# EasyEDA Pro project 电路图.eprj

# Schematic Schematic1
Board Name: Board1; Create Date: 2025-07-12; Page Name: P1; Project Name: 电路图; Schematic Name: Schematic1; Update Date: 2026-01-09; Company: 嘉立创EDA; Drawed: 陈师傅; Page Size: A4; Version: V1.0
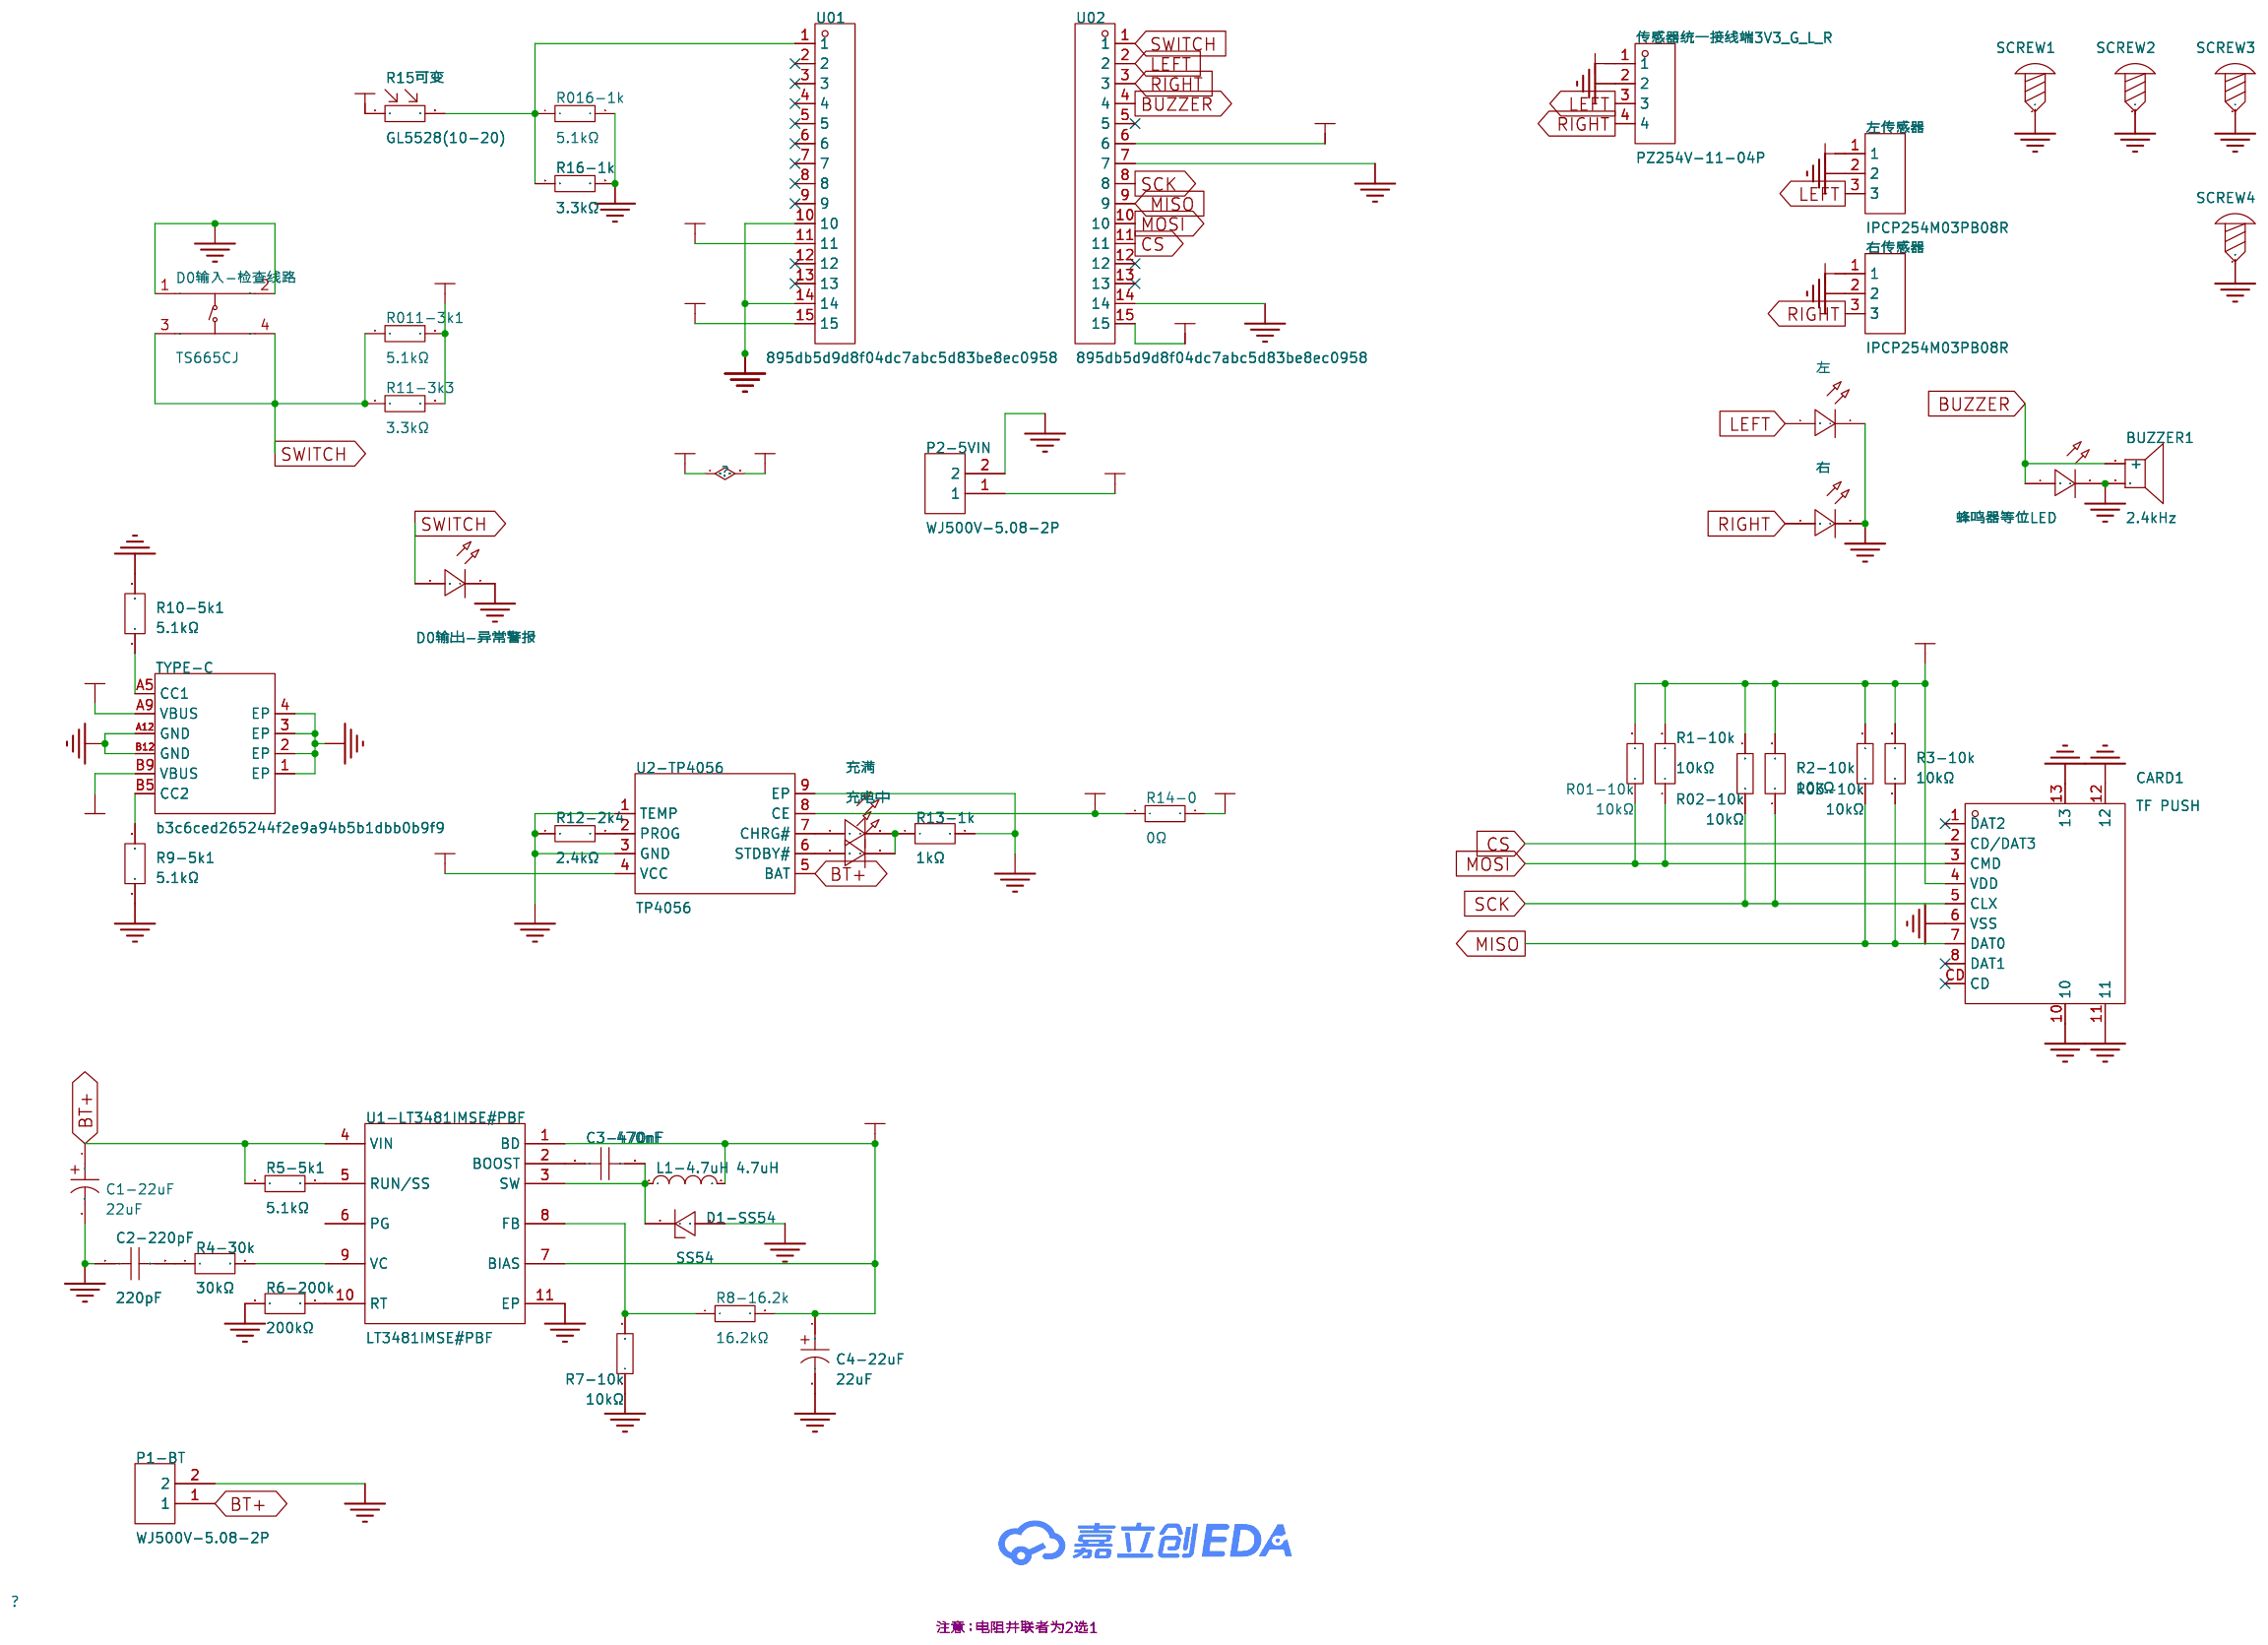
[diagram p0: schematic sheet]

## Parts
BUZZER1  2.4kHz  [BUZ-TH_BD12.0-P7.60-D0.6-FD]
C1-22uF  22uF  [CAP-TH_BD5.0-P2.00-D0.5-FD-1]
C2-220pF  220pF  [C1206]
C3-470nF  470nF  [C1206]
C4-22uF  22uF  [CAP-TH_BD5.0-P2.00-D0.5-FD-1]
CARD1  TF PUSH  [TF-SMD_TF-PUSH]
D0输入-检查线路  TS665CJ  [SW-TH_4P-L6.0-W6.0-P4.50-LS6.5]
D0输出-异常警报  -  [LED-TH_5mm]
D1-SS54  SS54  [SMA_L4.3-W2.6-LS5.0-FD]
L1-4.7uH  4.7uH  [IND-SMD_L7.0-W6.6]
P1-BT  WJ500V-5.08-2P  [CONN-TH_2P-P5.00_WJ500V-5.08-2P]
P2-5VIN  WJ500V-5.08-2P  [CONN-TH_2P-P5.00_WJ500V-5.08-2P]
R1-10k  10kΩ  [RES-TH_BD2.3-L6.3-P10.30-D0.6]
R01-10k  10kΩ  [R0603]
R02-10k  10kΩ  [R0603]
R2-10k  10kΩ  [RES-TH_BD2.3-L6.3-P10.30-D0.6]
R03-10k  10kΩ  [R0603]
R3-10k  10kΩ  [RES-TH_BD2.3-L6.3-P10.30-D0.6]
R4-30k  30kΩ  [R1206]
R5-5k1  5.1kΩ  [R0603]
R6-200k  200kΩ  [R1206]
R7-10k  10kΩ  [R0603]
R8-16.2k  16.2kΩ  [R0603]
R9-5k1  5.1kΩ  [RES-TH_BD2.3-L6.5-P10.50-D0.5]
R10-5k1  5.1kΩ  [RES-TH_BD2.3-L6.5-P10.50-D0.5]
R011-3k1  5.1kΩ  [R0603]
R11-3k3  3.3kΩ  [RES-TH_BD2.4-L6.3-P10.30-D0.6]
R12-2k4  2.4kΩ  [RES-TH_BD2.4-L6.3-P10.30-D0.6]
R13-1k  1kΩ  [RES-TH_BD2.7-L6.2-P10.20-D0.4]
R14-0  0Ω  [RES-TH_BD2.5-L6.5-P10.50-D0.6]
R15可变  GL5528(10-20)  [RES-TH_L5.1-W4.3-P3.40-D0.5]
R016-1k  5.1kΩ  [R0603]
R16-1k  3.3kΩ  [RES-TH_BD2.4-L6.3-P10.30-D0.6]
SCREW1  -  [M3螺丝]
SCREW2  -  [M3螺丝]
SCREW3  -  [M3螺丝]
SCREW4  -  [M3螺丝]
TYPE-C  b3c6ced265244f2e9a94b5b1dbb0b9f9  [USB-C-SMD_HC-TYPE-C-6P-010B]
U01  895db5d9d8f04dc7abc5d83be8ec0958  [HDR-TH_15P-P2.54-V-F-1]
U1-LT3481IMSE#PBF  LT3481IMSE#PBF  [MSOP-10_L3.0-W3.0-P0.50-LS5.0-BL-EP]
U02  895db5d9d8f04dc7abc5d83be8ec0958  [HDR-TH_15P-P2.54-V-F-1]
U2-TP4056  TP4056  [ESOP-8_L4.9-W3.9-P1.27-LS6.0-BL-EP]
传感器统一接线端3V3_G_L_R  PZ254V-11-04P  [HDR-TH_4P-P2.54-V-M]
充满  -  [LED-TH_5mm]
充电中  -  [LED-TH_5mm]
右  -  [LED-TH_5mm]
右传感器  IPCP254M03PB08R  [HDR-TH_3P-P2.54-H-M-W10.4]
左  -  [LED-TH_5mm]
左传感器  IPCP254M03PB08R  [HDR-TH_3P-P2.54-H-M-W10.4]
蜂鸣器等位LED  -  [LED-TH_5mm]

## Library data of the parts
BUZZER1 = TMB12A05_C96093: LCSC Part Name: TMB12A05; Supplier Part: C96093; Manufacturer: 华能; Manufacturer Part: TMB12A05; Supplier Footprint: 插件,D=12mm; JLCPCB Part Class: 扩展库; Datasheet: https://atta.szlcsc.com/upload/public/pdf/source/20241025/8A17FE04D767D19A35A06DEF9A82AB1E.pdf; Supplier: LCSC; Driver Circuitry: 有源(内含驱动线路); Technology: 电磁式; Voltage - Supply: 4V~8V; Sound Pressure Level(SPL): 85dB; Diameter(φD): 12mm; Height: 9.8mm
C1-22uF C4-22uF = SHC50V22UF03EC0750: LCSC Part Name: 停产 22uF ±20% 50V; Supplier Part: C5263893; Supplier Footprint: 插件,D5xL11mm; JLCPCB Part Class: 扩展库; Supplier: LCSC; Tolerance: ±20%; Voltage Rating: 50V; Pin Spacing: 2mm; Diameter: 5mm; Height - Seated (Max): 11mm
C2-220pF = FCC1206B221K102FT: LCSC Part Name: 220pF ±10% 1kV; Supplier Part: C5137559; Manufacturer: FOJAN(富捷); Supplier Footprint: 1206; JLCPCB Part Class: 扩展库; Datasheet: https://item.szlcsc.com/datasheet/FCC1206B221K102FT/5747011.html; Supplier: LCSC; Tolerance: ±10%; Voltage Rating: 1kV; Temperature Coefficient: X7R
C3-470nF = AC1206KKX7R9BB474: LCSC Part Name: 470nF ±10% 50V; Supplier Part: C2173665; Manufacturer: YAGEO(国巨); Supplier Footprint: 1206; JLCPCB Part Class: 扩展库; Datasheet: https://item.szlcsc.com/datasheet/AC1206KKX7R9BB474/2265731.html; Supplier: LCSC; Tolerance: ±10%; Voltage Rating: 50V; Temperature Coefficient: X7R
CARD1 = TF PUSH: 卡连接方式:自弹式;卡类型:MicroSD卡(TF卡);连接器类型:卡座;本体最大高度:2mm;工作温度范围:-20℃~+90℃;; LCSC Part Name: 自弹式 MicroSD卡(TF卡) 卡座; Supplier Part: C393941; Manufacturer: SHOU HAN(首韩); Supplier Footprint: SMD; JLCPCB Part Class: 扩展库; Datasheet: https://atta.szlcsc.com/upload/public/pdf/source/20191011/C393941_0DDD896EE907FEB750D8B7B8982E2A67.pdf; Supplier: LCSC; Card Connection Mode: 自弹式; Card Type: MicroSD卡(TF卡); Connector Type: 卡座; Additional Card Detection Pins: 无; Maximum Body Height: 2mm; Operating Temperature Range: -20℃~+90℃
D0输入-检查线路 = TS665CJ: LCSC Part Name: 6*6*5mm 直插 轻触开关; Supplier Part: C393938; Manufacturer: SHOU HAN(首韩); Supplier Footprint: 插件; JLCPCB Part Class: 扩展库; Datasheet: https://atta.szlcsc.com/upload/public/pdf/source/20190521/C393938_BDABEAC600B4C55E200A80AA129B70BC.pdf; Supplier: LCSC; Circuit: 单刀单掷; Actuator Style: 圆形按钮; Mounting Style: 直插; Switch Length: 6mm; Switch Width: 6mm; Switch Height: 5mm; Contact Current: 50mA; Voltage Rating (DC): 12V
D0输出-异常警报 充电中 右 左 = LED_TH-R_5mm: Supplier Footprint: 插件
D1-SS54 = SS54_C7420369: LCSC Part Name: 电压:40V 电流:5A; Supplier Part: C7420369; Manufacturer: R+O(宏嘉诚); Supplier Footprint: SMA(DO-214AC); JLCPCB Part Class: 扩展库; Datasheet: https://item.szlcsc.com/datasheet/SS54/8397191.html; Supplier: LCSC; Diode Configuration: 独立式; Voltage - Forward(Vf@If): 550mV@5.0A; Voltage - DC Reverse(Vr): 40V; Current - Rectified: 5A; Reverse Leakage Current (Ir): 50uA@40V; Operating Junction Temperature Range: -55℃~+125℃; Non-Repetitive Peak Forward Surge Current: 120A
L1-4.7uH = SL0630-4R7M: LCSC Part Name: 4.7uH ±20% 8A; Supplier Part: C22463821; Manufacturer: 台湾陆海; Supplier Footprint: SMD,7.1x6.6mm; JLCPCB Part Class: 扩展库; Datasheet: https://item.szlcsc.com/datasheet/SL0630-4R7M/24154963.html; Supplier: LCSC; Tolerance: ±20%; Current Rating: 6.5A; Current - Saturation (Isat): 8A
P1-BT P2-5VIN = WJ500V-5.08-2P: LCSC Part Name: 1x2P 5.08mm 直插 排数:1 每排P数:2; Supplier Part: C8465; Manufacturer: KANGNEX(康奈克斯电气); Supplier Footprint: 插件,P=5.08mm; JLCPCB Part Class: 扩展库; Datasheet: https://atta.szlcsc.com/upload/public/pdf/source/20191225/C8465_02D34CE5B5B4A53DF5891601D97FA9F4.pdf; Supplier: LCSC; Structure: 1x2P; Pitch: 5.08mm; Color: 绿色; Mounting Style: 直插; Current Rating (Max): 18A; Voltage Rating (Max): 250V; Number of Pins: 2P; Number of Rows: 1; Wire Gauge - AWG: 14~30; Wire Gauge - mm2: 2.5; Number of PINs Per Row: 2; Operating Temperature Range: -40℃~+105℃; Screw Specification: M2.5
R1-10k R2-10k R3-10k = LR1F10K: LCSC Part Name: 金属膜电阻 10kΩ ±1% 600mW; Supplier Part: C1367502; Manufacturer: TE Connectivity(泰科电子); Supplier Footprint: 插件; JLCPCB Part Class: 扩展库; Datasheet: https://item.szlcsc.com/datasheet/LR1F10K/1457791.html; Supplier: LCSC; Type: 金属膜电阻; Tolerance: ±1%; Power(Watts): 600mW; Temperature Coefficient: ±50ppm/℃; Operating Temperature: -55℃~+155℃
R01-10k R02-10k R03-10k R7-10k = 0603WAF1002T5E: 电阻类型:厚膜电阻;阻值:10kΩ;精度:±1%;功率:100mW;工作电压:75V;温度系数:±100ppm/℃;; LCSC Part Name: 厚膜电阻 10kΩ ±1% 100mW; Supplier Part: C25804; Manufacturer: UNI-ROYAL(厚声); Supplier Footprint: 0603; JLCPCB Part Class: Basic Part; Datasheet: https://atta.szlcsc.com/upload/public/pdf/source/20200306/C422600_1E6D84923E4A46A82E41ADD87F860B5C.pdf; Supplier: LCSC; Type: 厚膜电阻; Tolerance: ±1%; Power(Watts): 100mW; Voltage-Supply(Max): 75V; Temperature Coefficient: ±100ppm/℃; Operating Temperature: -55℃~+155℃
R4-30k = RCA0630KFLF: LCSC Part Name: 30kΩ ±1% 250mW; Supplier Part: C22370009; Manufacturer: HKR(香港电阻); Supplier Footprint: 1206; JLCPCB Part Class: 扩展库; Datasheet: https://item.szlcsc.com/datasheet/RCA0630KFLF/23849040.html; Supplier: LCSC; Type: 厚膜电阻; Tolerance: ±1%; Power(Watts): 250mW; Voltage-Supply(Max): 200V; Temperature Coefficient: ±100ppm/℃; Operating Temperature: -55℃~+155℃
R5-5k1 R011-3k1 R016-1k = 0603WAF5101T5E: LCSC Part Name: 5.1kΩ ±1% 100mW 厚膜电阻; Supplier Part: C23186; Manufacturer: UNI-ROYAL(厚声); Supplier Footprint: 0603; JLCPCB Part Class: 基础库; Datasheet: https://item.szlcsc.com/datasheet/0603WAF5101T5E/23913.html; Supplier: LCSC; Type: 厚膜电阻; Tolerance: ±1%; Power(Watts): 100mW; Voltage-Supply(Max): 75V; Temperature Coefficient: ±100ppm/℃; Operating Temperature: -55℃~+155℃
R6-200k = TC0650B2003T5J: LCSC Part Name: 200kΩ ±0.1% 250mW 薄膜电阻; Supplier Part: C2989381; Manufacturer: UNI-ROYAL(厚声); Supplier Footprint: 1206; JLCPCB Part Class: 扩展库; Datasheet: https://item.szlcsc.com/datasheet/TC0650B2003T5J/3448804.html; Supplier: LCSC; Type: 薄膜电阻; Tolerance: ±0.1%; Power(Watts): 250mW; Voltage-Supply(Max): 200V; Temperature Coefficient: ±50ppm/℃; Operating Temperature: -55℃~+155℃
R8-16.2k = 0603WAF1622T5E: LCSC Part Name: 16.2kΩ ±1% 100mW 厚膜电阻; Supplier Part: C22885; Manufacturer: UNI-ROYAL(厚声); Supplier Footprint: 0603; JLCPCB Part Class: 扩展库; Datasheet: https://item.szlcsc.com/datasheet/0603WAF1622T5E/23612.html; Supplier: LCSC; Type: 厚膜电阻; Tolerance: ±1%; Power(Watts): 100mW; Voltage-Supply(Max): 75V; Temperature Coefficient: ±100ppm/℃; Operating Temperature: -55℃~+155℃
R9-5k1 R10-5k1 = MF1/4W-5.1KΩ±1%T52: LCSC Part Name: 金属膜电阻 5.1kΩ ±1% 250mW; Supplier Part: C714010; Manufacturer: 华星机电; Supplier Footprint: 插件,D2.3xL6.5mm; JLCPCB Part Class: 扩展库; Datasheet: https://atta.szlcsc.com/upload/public/pdf/source/20200731/C713882_AE8EB1102749D7E4FB4FB13DC898C429.pdf; Supplier: LCSC; Type: 金属膜电阻; Tolerance: ±1%; Power(Watts): 250mW; Temperature Coefficient: ±200ppm/℃
R11-3k3 R16-1k = MFR50SFTE52-3K3: LCSC Part Name: 金属膜电阻 3.3kΩ ±1% 500mW 铜脚，圆柱状直插; Supplier Part: C173154; Manufacturer: YAGEO(国巨); Supplier Footprint: 插件,D2.4xL6.3mm; JLCPCB Part Class: 扩展库; Datasheet: https://atta.szlcsc.com/upload/public/pdf/source/20240715/954B77424FA37AD87C8D0E9E8395A6B5.pdf; Supplier: LCSC; Type: 金属膜电阻; Tolerance: ±1%; Power(Watts): 500mW; Temperature Coefficient: ±50ppm/℃; Operating Temperature: -55℃~+155℃
R12-2k4 = MFR-25FTE52-2K4: LCSC Part Name: 金属膜电阻 2.4kΩ ±1% 250mW 铜脚，圆柱状直插; Supplier Part: C172998; Manufacturer: YAGEO(国巨); Supplier Footprint: 插件,D2.4xL6.3mm; JLCPCB Part Class: 扩展库; Datasheet: https://atta.szlcsc.com/upload/public/pdf/source/20191118/C457825_18355E864DE4965678DC27B0EBC3E21E.pdf; Supplier: LCSC; Type: 金属膜电阻; Tolerance: ±1%; Power(Watts): 250mW; Temperature Coefficient: ±50ppm/℃; Operating Temperature: -55℃~+155℃
R13-1k = MF1/4W-1K±1%-ST52: LCSC Part Name: 金属膜电阻 1kΩ ±1% 250mW; Supplier Part: C2903245; Manufacturer: VO(翔胜); Supplier Footprint: 插件,D2.7xL6.2mm; JLCPCB Part Class: 扩展库; Datasheet: https://atta.szlcsc.com/upload/public/pdf/source/20241217/72FEFC4F99972FE0FB9B38B807463E29.pdf; Supplier: LCSC; Type: 金属膜电阻; Tolerance: ±1%; Voltage-Supply(Max): 250V; Power(Watts): 250mW; Temperature Coefficient: ±100ppm/℃; Operating Temperature: -55℃~+155℃
R14-0 = RN1/4W0RT/BA1: LCSC Part Name: 金属膜电阻 0Ω ±1% 250mW; Supplier Part: C410698; Manufacturer: Tyohm(幸亚电阻); Supplier Footprint: 插件,D2.4xL6.4mm; JLCPCB Part Class: 扩展库; Datasheet: https://item.szlcsc.com/datasheet/RN1%252F4W0RT%252FBA1/401619.html; Supplier: LCSC; Type: 金属膜电阻; Tolerance: ±1%; Power(Watts): 250mW
R15可变 = GL5528(10-20)_C10081: Supplier Part: C10081; Manufacturer: JCHL(晶创和立); Supplier Footprint: 插件,P=3.4mm; JLCPCB Part Class: 扩展库; Datasheet: https://atta.szlcsc.com/upload/public/pdf/source/20200417/C515010_C10502EF7F431E893A7F20DB83F527F0.pdf; Supplier: LCSC; Dark Resistance: 1MΩ; Cell Resistance @ Illuminance: 10kΩ~20kΩ; Voltage - Max: 150V; Wavelength - Peak: 540nm
SCREW1-SCREW4 = M3螺丝: Supplier Footprint: 插件
TYPE-C = HC-TYPE-C-6P-010C: 连接器类型:Type-C;协议标准:-;公母:母;安装方式:卧贴;触点数量:6P;端口数量:1;额定电流 - 电源:3A;工作温度:-25℃~+85℃;; LCSC Part Name: 黑色 Type-C 母 卧贴 TYPE-C-6P 板上型无弹 L6.8mm 304不锈钢 LCP; Supplier Part: C19274014; Manufacturer: HC(虹成电子); Supplier Footprint: SMD; JLCPCB Part Class: 扩展库; Datasheet: https://atta.szlcsc.com/upload/public/pdf/source/20250217/CDACBD6800B28C1A11746C396D8A6A67.pdf; Supplier: LCSC; Connector Type: Type-C; Gender: 母; Mounting Type: 卧贴; Number of Contacts: 6P; Number of Ports: 1; Current Rating-Power: 3A; Voltage Rating: 5V; Connect-Disconnect Life: 5千次; Center Height: 1.58mm; Length: 6.8mm; Detection color: 黑色; Operating Temperature: -25℃~+85℃
U01 U02 = BX-PM2.54-1-15PY: 插孔结构:1x15P;间距:2.54mm;行距:-;圆孔/方孔:方孔;安装方式:直插;排数:单排;总孔位数:15P;额定电流:3A;额定电压:-;插孔方向:顶部;塑高:8.5mm;触头材质:-;触头镀层:金;工作温度:-40℃~+105℃;; LCSC Part Name: 1x15P 间距:2.54mm 直插; Supplier Part: C18078136; Manufacturer: Bossie(博锡); Supplier Footprint: 插件,P=2.54mm; JLCPCB Part Class: 扩展库; Datasheet: https://atta.szlcsc.com/upload/public/pdf/source/20231017/E7C87C5FAA326EA1BCED90F41F0BE953.pdf; Supplier: LCSC; Holes Structure: 1x15P; Pitch: 2.54mm; Circular Hole / Square Hole: 方孔; Mounting Type: 直插; Number of Rows: 单排; Number of Positions: 15P; Current Rating: 3A; Holes Direction: 顶部; Insulation Height: 8.5mm; Contact Plating: 金; Operating Temperature: -40℃~+105℃; PIN Length: 3.2mm
U1-LT3481IMSE#PBF = LT3481IMSE#PBF: LCSC Part Name: 具有 50uA 静态电流的 36V、2A、2.8MHz 降压型开关稳压器; Supplier Part: C27276; Manufacturer: ADI(亚德诺); Supplier Footprint: MSOP-10-EP; JLCPCB Part Class: 扩展库; Datasheet: https://atta.szlcsc.com/upload/public/pdf/source/20140319/1457707024098.pdf; Supplier: LCSC
U2-TP4056 = TP4056_C725790: LCSC Part Name: 1A独立式线性锂离子电池充电器; Supplier Part: C725790; Manufacturer: UMW(友台半导体); Supplier Footprint: ESOP-8; JLCPCB Part Class: 扩展库; Datasheet: https://item.szlcsc.com/datasheet/TP4056/772193.html; Supplier: LCSC; The Chip Type: 线性充电芯片; Voltage - Supply: 3.7V~6.5V; Charge Current - Max: 1A; Charging Saturation Voltage: 4.2V; Type of Battery: 锂离子; Number of Cells: 1; Operating Temperature: -40℃~+85℃; Battery Temperature Detection: 支持; 0V Battery Charge: 支持; Supply Current (Iq): 35uA
传感器统一接线端3V3_G_L_R = PZ254V-11-04P: LCSC Part Name: 1x4P 间距:2.54mm 方针 直插; Supplier Part: C2691448; Manufacturer: XFCN(兴飞); Supplier Footprint: 插件,P=2.54mm; JLCPCB Part Class: 扩展库; Datasheet: https://item.szlcsc.com/datasheet/PZ254V-11-04P/2801085.html; Supplier: LCSC; Pin Structure: 1x4P; Pitch: 2.54mm; Circluar Pins/Square Pins: 方针; Mounting Type: 直插; Number of Rows: 单排; Number of Pins: 4P; Current Rating: 3A; Voltage Rating (Max): 250V; Length of Mating Pin: 6mm; Insulation Height: 2.5mm; Length of End Connection Pin: 3mm; Operating Temperature: -40℃~+105℃; Color: 黑色
充满 蜂鸣器等位LED = LED_TH-G_5mm: Supplier Footprint: 插件
右传感器 左传感器 = IPCP254M03PB08R: 插针结构:1x3P;间距:2.54mm;圆针/方针:方针;安装方式:弯插;排数:单排;总PIN位数:3P;额定电流:3A;额定电压:-;塑高:2.5mm;触头材质:黄铜;触头镀层:金;工作温度:-40℃~+105℃;颜色:黑色;; LCSC Part Name: 1x3P 间距:2.54mm 方针 弯插; Supplier Part: C22395593; Manufacturer: INCP; Supplier Footprint: 弯插,P=2.54mm; JLCPCB Part Class: 扩展库; Datasheet: https://atta.szlcsc.com/upload/public/pdf/source/20250208/975C7ED3E6965D9726D213BB1A1DEC82.pdf; Supplier: LCSC; Pin Structure: 1x3P; Pitch: 2.54mm; Circluar Pins/Square Pins: 方针; Mounting Type: 弯插; Number of Rows: 单排; Number of Pins: 3P; Current Rating: 3A; Insulation Height: 2.5mm; Contact Material: 黄铜; Contact Plating: 金; Operating Temperature: -40℃~+105℃; Color: 黑色

## Nets
3V3: C4-22uF.1 CARD1.4(VDD) L1-4.7uH.2 R1-10k.2 R01-10k.2 R02-10k.2 R2-10k.2 R03-10k.2 R3-10k.2 R8-16.2k.2 R011-3k1.2 R11-3k3.2 R15可变.1 U01.11 U1-LT3481IMSE#PBF.1(BD) U1-LT3481IMSE#PBF.7(BIAS) U02.6 U02.15 传感器统一接线端3V3_G_L_R.1 右传感器.1 左传感器.1
+5V: P2-5VIN.1 R14-0.2 U01.15
GND: BUZZER1.2 C1-22uF.2 C2-220pF.1 C4-22uF.2 CARD1.6(VSS) CARD1.10 CARD1.11 CARD1.12 CARD1.13 D0输入-检查线路.1(A) D0输入-检查线路.2(B) D0输出-异常警报.2(A) D1-SS54.1(A) P1-BT.2 P2-5VIN.2 R6-200k.1 R7-10k.1 R9-5k1.1 R10-5k1.2 R12-2k4.1 R13-1k.2 R016-1k.2 R16-1k.2 SCREW1.1 SCREW2.1 SCREW3.1 SCREW4.1 TYPE-C.1(EP) TYPE-C.2(EP) TYPE-C.3(EP) TYPE-C.4(EP) TYPE-C.A12(GND) TYPE-C.B12(GND) U01.10 U01.14 U1-LT3481IMSE#PBF.11(EP) U02.7 U02.14 U2-TP4056.1(TEMP) U2-TP4056.3(GND) U2-TP4056.9(EP) 传感器统一接线端3V3_G_L_R.2 右.2(A) 右传感器.2 左.2(A) 左传感器.2 蜂鸣器等位LED.2(A)
BT+: C1-22uF.1 P1-BT.1 R5-5k1.1 U1-LT3481IMSE#PBF.4(VIN) U2-TP4056.5(BAT)
BUZZER: BUZZER1.1(+) U02.4 蜂鸣器等位LED.1(C)
CS: CARD1.2(CD/DAT3) U02.11
LEFT: U02.2 传感器统一接线端3V3_G_L_R.3 左.1(C) 左传感器.3
MISO: CARD1.7(DAT0) R03-10k.1 R3-10k.1 U02.9
MOSI: CARD1.3(CMD) R1-10k.1 R01-10k.1 U02.10
RIGHT: U02.3 传感器统一接线端3V3_G_L_R.4 右.1(C) 右传感器.3
SCK: CARD1.5(CLX) R02-10k.1 R2-10k.1 U02.8
SWITCH: D0输入-检查线路.3(C) D0输入-检查线路.4(D) D0输出-异常警报.1(C) R011-3k1.1 R11-3k3.1 U02.1
USBIN: R14-0.1 TYPE-C.A9(VBUS) TYPE-C.B9(VBUS) U2-TP4056.4(VCC) U2-TP4056.8(CE)
$1N5991: R9-5k1.2 TYPE-C.B5(CC2)
$1N5992: R10-5k1.1 TYPE-C.A5(CC1)
$1N6384: R12-2k4.2 U2-TP4056.2(PROG)
$1N6472: U2-TP4056.6(STDBY#) 充电中.1(C)
$1N6520: U2-TP4056.7(CHRG#) 充满.1(C)
$1N6547: R13-1k.1 充满.2(A) 充电中.2(A)
$1N28440: R15可变.2 R016-1k.1 R16-1k.1 U01.1
$1N40882: C3-470nF.1 U1-LT3481IMSE#PBF.2(BOOST)
$1N40886: C3-470nF.2 D1-SS54.2(K) L1-4.7uH.1 U1-LT3481IMSE#PBF.3(SW)
$1N41122: R6-200k.2 U1-LT3481IMSE#PBF.10(RT)
$1N41387: R4-30k.2 U1-LT3481IMSE#PBF.9(VC)
$1N41394: C2-220pF.2 R4-30k.1
$1N41433: R5-5k1.2 U1-LT3481IMSE#PBF.5(RUN/SS)
$1N41446: R7-10k.2 R8-16.2k.1 U1-LT3481IMSE#PBF.8(FB)

Not connected (* = marked no-connect by the designer): CARD1 1(DAT2)* 8(DAT1)* CD*; U01 2* 3* 4* 5* 6* 7* 8* 9* 12* 13*; U1-LT3481IMSE#PBF 6(PG); U02 5* 12* 13*

# Board PCB1
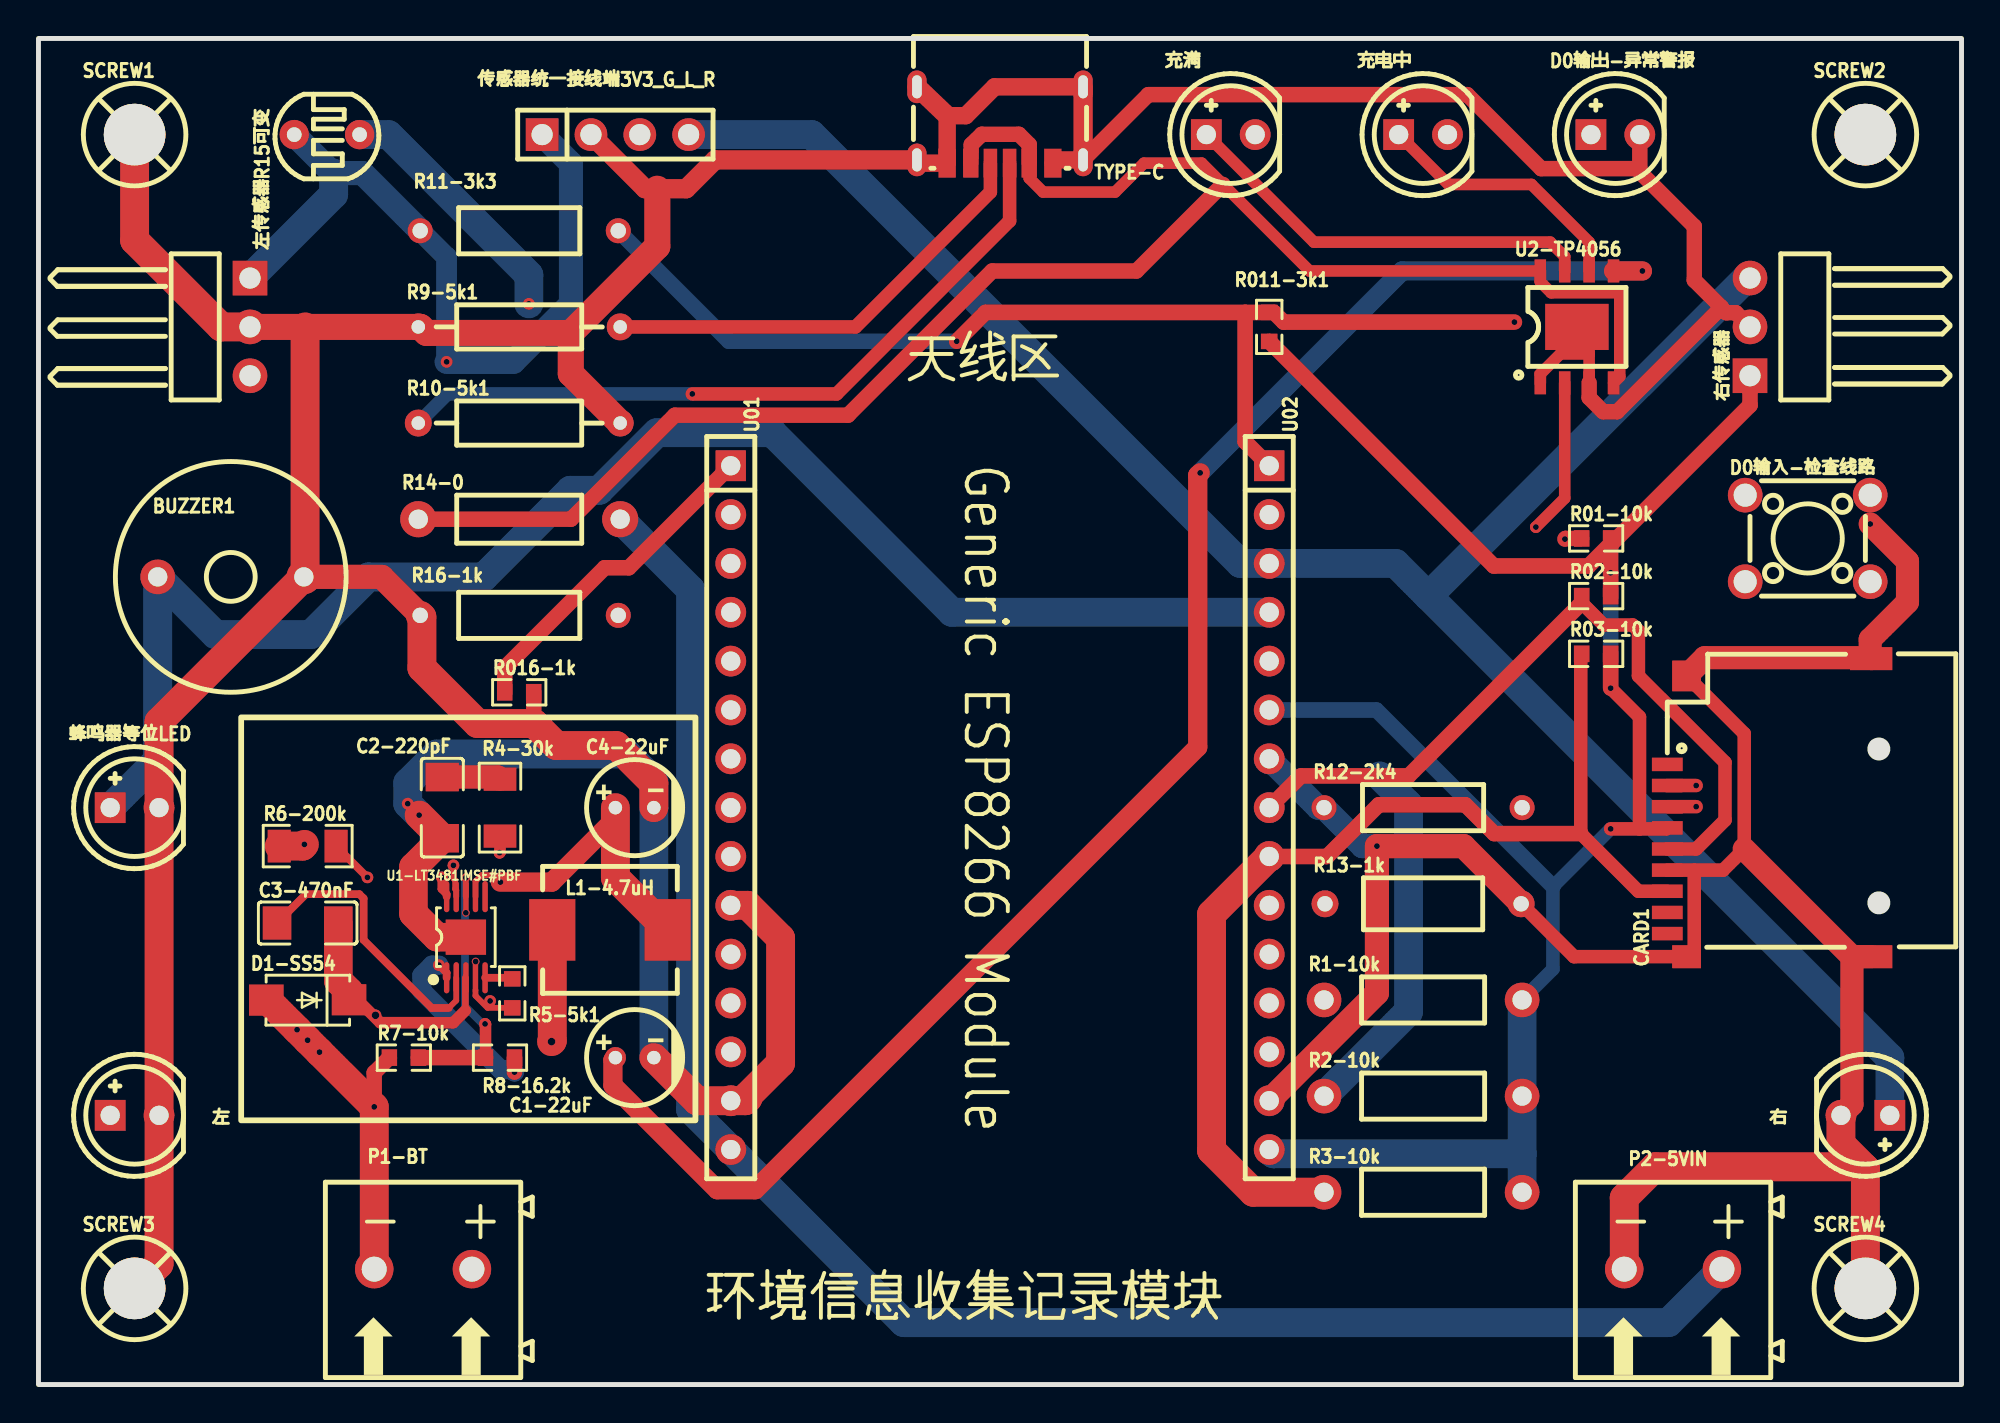
[diagram p1: board, top side]
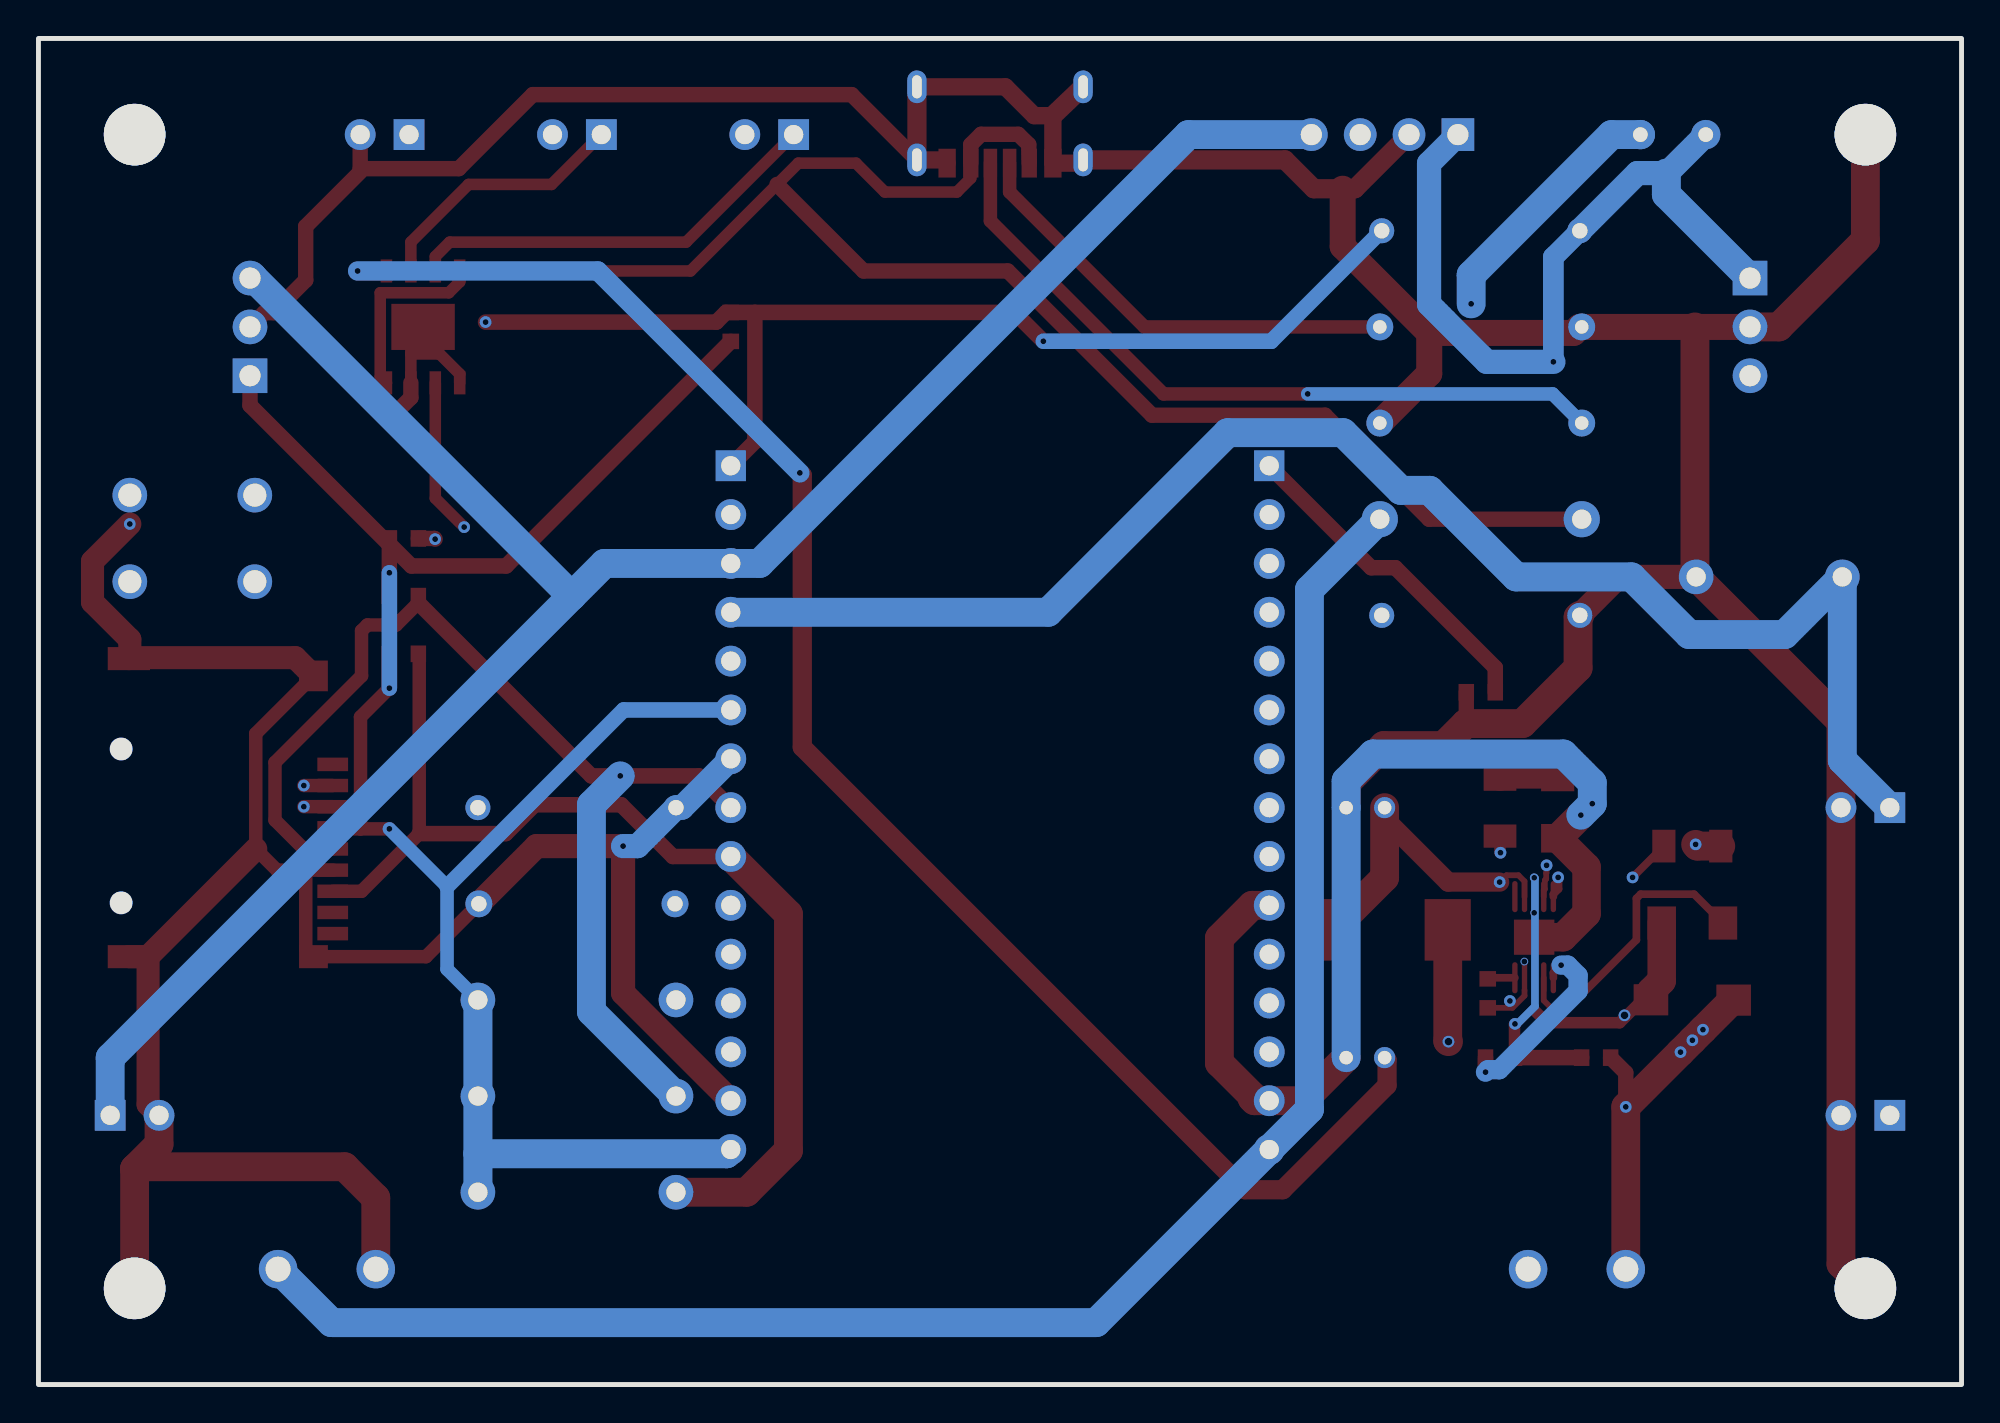
[diagram p2: board, bottom side, seen from below]

Outline 100 x 70 mm; copper layers: Top Layer, Inner1, Inner2, Bottom Layer. Coordinates in mm from the lower left corner of the outline.
Outline path: rectangle 0,70 100,0
Stack: Top Layer 0.035mm 外层铜厚1oz / Dielectric1 0.2104mm 7628 RC49% 8.6mil / Inner1 0.0152mm 内层铜厚 / Dielectric2 1.065mm 1.1mm H/HOZ Copper / Inner2 0.0152mm 内层铜厚 / Dielectric3 0.2104mm 7628 RC49% 8.6mil / Bottom Layer 0.035mm 外层铜厚1oz

## Design rules (mm)
template: 自定义配置
spacing copperThickness1oz (default): track to track 0.15, other pairs 0.152 to 0.3
spacing copperThickness2oz: track to track 0.203, other pairs 0.152 to 0.3
track width copperThickness1oz (default): min 0.3, default 1, max 3
track width copperThickness2oz: min 0.203, default 0.254, max 2.54
differential pair differentialPair (default): width min 0.127, default 0.254, max 2.54; gap min 0.152, default 0.152
via viaSize (default): diameter min 0.35, default 0.61, max 10; hole min 0.3, default 0.305, max 6.3

## Placement (name value [footprint] x y rotation side)
BUZZER1  2.4kHz  [BUZ-TH_BD12.0-P7.60-D0.6-FD]  10 42 0 top
C1-22uF  22uF  [CAP-TH_BD5.0-P2.00-D0.5-FD-1]  31 17 0 top
C2-220pF  220pF  [C1206]  21 30 90 top
C3-470nF  470nF  [C1206]  14 24 0 top
C4-22uF  22uF  [CAP-TH_BD5.0-P2.00-D0.5-FD-1]  31 30 0 top
CARD1  TF PUSH  [TF-SMD_TF-PUSH]  90 30 90 top
D0输入-检查线路  TS665CJ  [SW-TH_4P-L6.0-W6.0-P4.50-LS6.5]  92 44 0 top
D0输出-异常警报  -  [LED-TH_5mm]  82 65 0 top
D1-SS54  SS54  [SMA_L4.3-W2.6-LS5.0-FD]  14 20 0 top
L1-4.7uH  4.7uH  [IND-SMD_L7.0-W6.6]  29.72 23.64 0 top
P1-BT  WJ500V-5.08-2P  [CONN-TH_2P-P5.00_WJ500V-5.08-2P]  20 6 180 top
P2-5VIN  WJ500V-5.08-2P  [CONN-TH_2P-P5.00_WJ500V-5.08-2P]  85 6 180 top
R1-10k  10kΩ  [RES-TH_BD2.3-L6.3-P10.30-D0.6]  72 20 0 top
R01-10k  10kΩ  [R0603]  81 44 0 top
R2-10k  10kΩ  [RES-TH_BD2.3-L6.3-P10.30-D0.6]  72 15 0 top
R02-10k  10kΩ  [R0603]  81 41 0 top
R3-10k  10kΩ  [RES-TH_BD2.3-L6.3-P10.30-D0.6]  72 10 0 top
R03-10k  10kΩ  [R0603]  81 38 0 top
R4-30k  30kΩ  [R1206]  24 30 270 top
R5-5k1  5.1kΩ  [R0603]  24.64 20.34 90 top
R6-200k  200kΩ  [R1206]  14 28 0 top
R7-10k  10kΩ  [R0603]  19 17 0 top
R8-16.2k  16.2kΩ  [R0603]  24 17 0 top
R9-5k1  5.1kΩ  [RES-TH_BD2.3-L6.5-P10.50-D0.5]  25 55 0 top
R10-5k1  5.1kΩ  [RES-TH_BD2.3-L6.5-P10.50-D0.5]  25 50 0 top
R011-3k1  5.1kΩ  [R0603]  64 55 270 top
R11-3k3  3.3kΩ  [RES-TH_BD2.4-L6.3-P10.30-D0.6]  25 60 180 top
R12-2k4  2.4kΩ  [RES-TH_BD2.4-L6.3-P10.30-D0.6]  72 30 0 top
R13-1k  1kΩ  [RES-TH_BD2.7-L6.2-P10.20-D0.4]  72 25 0 top
R14-0  0Ω  [RES-TH_BD2.5-L6.5-P10.50-D0.6]  25 45 0 top
R15可变  GL5528(10-20)  [RES-TH_L5.1-W4.3-P3.40-D0.5]  15 65 90 top
R16-1k  3.3kΩ  [RES-TH_BD2.4-L6.3-P10.30-D0.6]  25 40 180 top
R016-1k  5.1kΩ  [R0603]  25 36 0 top
SCREW1  -  [M3螺丝]  5 65 0 top
SCREW2  -  [M3螺丝]  95 65 0 top
SCREW3  -  [M3螺丝]  5 5 0 top
SCREW4  -  [M3螺丝]  95 5 0 top
TYPE-C  b3c6ced265244f2e9a94b5b1dbb0b9f9  [USB-C-SMD_HC-TYPE-C-6P-010B]  50 65.5 180 top
U01  895db5d9d8f04dc7abc5d83be8ec0958  [HDR-TH_15P-P2.54-V-F-1]  36 30 270 top
U1-LT3481IMSE#PBF  LT3481IMSE#PBF  [MSOP-10_L3.0-W3.0-P0.50-LS5.0-BL-EP]  22.22 23.26 0 top
U02  895db5d9d8f04dc7abc5d83be8ec0958  [HDR-TH_15P-P2.54-V-F-1]  64 30 270 top
U2-TP4056  TP4056  [ESOP-8_L4.9-W3.9-P1.27-LS6.0-BL-EP]  80 55 0 top
传感器统一接线端3V3_G_L_R  PZ254V-11-04P  [HDR-TH_4P-P2.54-V-M]  30 65 0 top
充满  -  [LED-TH_5mm]  62 65 0 top
充电中  -  [LED-TH_5mm]  72 65 0 top
右  -  [LED-TH_5mm]  95 14 180 top
右传感器  IPCP254M03PB08R  [HDR-TH_3P-P2.54-H-M-W10.4]  89 55 90 top
左  -  [LED-TH_5mm]  5 14 0 top
左传感器  IPCP254M03PB08R  [HDR-TH_3P-P2.54-H-M-W10.4]  11 55 270 top
蜂鸣器等位LED  -  [LED-TH_5mm]  5 30 0 top

## Footprints (pads in the part's own frame, mm; a bottom-side part is the same pattern mirrored in y, then rotated)
BUZ-TH_BD12.0-P7.60-D0.6-FD
  round 1.8 hole 1: 1(-3.8,0) 2(3.8,0)
C1206
  rect 1.485x1.728 smd: 1(-1.593,0) 2(1.593,0)
CAP-TH_BD5.0-P2.00-D0.5-FD-1
  round 1.1 hole 0.7: 1(-1,0) 2(1,0)
CONN-TH_2P-P5.00_WJ500V-5.08-2P
  round 2 hole 1.3: 1(-2.54,0) 2(2.54,0)
ESOP-8_L4.9-W3.9-P1.27-LS6.0-BL-EP
  rect 0.6x1.2 smd: 1(-1.905,-2.909) 2(-0.635,-2.909) 3(0.635,-2.909) 4(1.905,-2.909) 5(1.905,2.909) 6(0.635,2.909) 7(-0.635,2.909) 8(-1.905,2.909)
  rect 3.3x2.4 smd: 9(0,0)
HDR-TH_3P-P2.54-H-M-W10.4
  rect 1.8x1.8 hole 1.1: 1(-2.54,0)
  round 1.8 hole 1.1: 2(0,0) 3(2.54,0)
HDR-TH_4P-P2.54-V-M
  rect 1.7x1.7 hole 1.1: 1(-3.81,0)
  round 1.7 hole 1.1: 2(-1.27,0) 3(1.27,0) 4(3.81,0)
HDR-TH_15P-P2.54-V-F-1
  rect 1.6x1.575 hole 1: 1(-17.78,0)
  round 1.6 hole 1: 2(-15.24,0) 3(-12.7,0) 4(-10.16,0) 5(-7.62,0) 6(-5.08,0) 7(-2.54,0) 8(0,0) 9(2.54,0) 10(5.08,0) 11(7.62,0) 12(10.16,0) 13(12.7,0) 14(15.24,0) 15(17.78,0)
IND-SMD_L7.0-W6.6
  rect 2.4x3.2 smd: 1(-3,0) 2(3,0)
LED-TH_5mm
  rect 1.6x1.6 hole 1: 1(-1.27,0)
  round 1.6 hole 1: 2(1.27,0)
M3螺丝
  round 3.2 hole 3.2: 1(0,0)
MSOP-10_L3.0-W3.0-P0.50-LS5.0-BL-EP
  oval 0.28x1.62 smd: 1(-1,-2.11) 2(-0.5,-2.11) 3(0,-2.11) 4(0.5,-2.11) 5(1,-2.11) 6(1,2.11) 7(0.5,2.11) 8(0,2.11) 9(-0.5,2.11) 10(-1,2.11)
  rect 2.1x1.83 smd: 11(0,0)
R0603
  rect 0.806x0.864 smd: 1(-0.753,0) 2(0.753,0)
R1206
  rect 1.208x1.701 smd: 1(-1.479,0) 2(1.479,0)
RES-TH_BD2.3-L6.3-P10.30-D0.6
  round 1.8 hole 1: 1(-5.15,0) 2(5.15,0)
RES-TH_BD2.3-L6.5-P10.50-D0.5
  round 1.4 hole 0.7: 1(-5.25,0) 2(5.25,0)
RES-TH_BD2.4-L6.3-P10.30-D0.6
  round 1.3 hole 0.8: 1(-5.15,0) 2(5.15,0)
RES-TH_BD2.5-L6.5-P10.50-D0.6
  round 1.879 hole 1: 1(-5.25,0) 2(5.25,0)
RES-TH_BD2.7-L6.2-P10.20-D0.4
  round 1.4 hole 0.8: 1(-5.1,0) 2(5.1,0)
RES-TH_L5.1-W4.3-P3.40-D0.5
  round 1.524 hole 0.762: 1(0,1.7) 2(0,-1.7)
SMA_L4.3-W2.6-LS5.0-FD
  rect 1.8x1.62 smd: 1(-2.15,-0.009) 2(2.15,0.009)
SW-TH_4P-L6.0-W6.0-P4.50-LS6.5
  round 1.8 hole 1.2: 1(-3.25,2.25) 2(3.25,2.25) 3(-3.25,-2.25) 4(3.25,-2.25)
TF-SMD_TF-PUSH
  rect 0.7x1.6 smd: 1(2.25,5.3) 2(1.15,5.3) 3(0.05,5.3) 4(-1.05,5.3) 5(-2.15,5.3) 6(-3.25,5.3) 7(-4.35,5.3) 8(-5.45,5.3) CD(-6.55,5.3)
  rect 1.2x1.5 smd: 10(-7.75,4.3)
  rect 1.2x2.2 smd: 11(-7.75,-5.3) 12(7.75,-5.3)
  rect 1.6x1.5 smd: 13(6.85,4.3)
USB-C-SMD_HC-TYPE-C-6P-010B
  oval 1x1.7 hole 0.5x1.2: 1(-4.32,1.815) 2(4.32,1.815) 3(-4.32,-1.985) 4(4.32,-1.985)
  rect 0.7x1.5 smd: A5(-0.5,1.985) B5(0.5,1.985)
  rect 0.8x1.5 smd: A9(1.52,1.985) B9(-1.52,1.985)
  rect 0.9x1.5 smd: A12(2.75,1.985) B12(-2.75,1.985)

## Nets
As in the schematic.

Pads without a net: CARD1 1 8 CD; U01 2 3 4 5 6 7 8 9 12 13; U1-LT3481IMSE#PBF 6; U02 5 12 13

## Via types
v1: diameter 0.61, hole 0.305, Top Layer to Bottom Layer, 32 vias
v2: diameter 0.7, hole 0.3, Top Layer to Bottom Layer, 1 via
v3: diameter 0.4, hole 0.305, Top Layer to Bottom Layer, 1 via
v4: diameter 0.61, hole 0.4, Top Layer to Bottom Layer, 2 vias
v5: diameter 0.4, hole 0.3, Top Layer to Bottom Layer, 1 via
v6: diameter 0.45, hole 0.3, Top Layer to Bottom Layer, 1 via

## Routing (per net, layer and track width the routed paths; a pad name or vN(x,y) marks a point on that pad's centre or on a via; arc(x,y) is an arc through that point)
3V3: length 251.9
  Top Layer w0.3: U1-LT3481IMSE#PBF.7 22.72,26.17 23.04,26.49 23.66,26.49 v1(24.02,26.13)
  Top Layer w0.4: U1-LT3481IMSE#PBF.1 21.22,21.41 v1(20.82,21.81)
  Top Layer w0.7: v1(81.75,36.21) 83.25,34.71 83.25,28.9 ; CARD1.4 84.65,28.9 83.25,28.9 ; 83.25,28.9 v1(81.75,28.9)
  Top Layer w0.806: R02-10k.2 v1(81.75,42.21) 81.75,43.71 ; v1(81.75,36.21) R03-10k.2 ; 81.75,43.71 80.61,42.57 75.68,42.57 R011-3k1.2 ; 81.75,43.71 81.79,43.71 89,50.92 右传感器.1 ; v1(24.75,16.25) R8-16.2k.2
  Top Layer w1: 30,29.43 26.69,26.13 v1(24.02,26.13)
  Top Layer w1.5: C4-22uF.1 30,26.36 L1-4.7uH.2
  Inner2 w1: C4-22uF.1 30,26.67 34.28,22.38 U01.11 ; v1(24.02,26.13) 24.02,25 v1(20.82,21.81)
  Inner2 w1.077: v1(21.22,53.18) 21.22,47.03 29.97,38.28 29.97,30.42
  Inner2 w1.5: U02.15 53.84,22.38 U01.11
  Bottom Layer w0.7: v1(81.75,28.9) 78.75,25.9 78.75,21.6 R1-10k.2
  Bottom Layer w0.806: 78.75,25.9 69.57,35.08 U02.6 ; v1(81.75,42.21) v1(81.75,36.21)
  Bottom Layer w1: v1(20.82,21.81) 20.47,21.81 19.94,21.27 19.94,20.47 24.04,16.37 24.63,16.37 v1(24.75,16.25)
  Bottom Layer w1.077: R11-3k3.2 21.22,58.62 v1(21.22,53.18)
  Bottom Layer w1.256: v1(21.22,53.18) 24.69,53.18 27.69,56.18 27.69,63.5 传感器统一接线端3V3_G_L_R.1 ; R15可变.1 15.3,63 16.85,63 R11-3k3.2
  Bottom Layer w1.5: 左传感器.1 15.35,61.89 15.35,63 ; 77.15,12 R2-10k.2 R1-10k.2 ; 77.15,12 64.22,12 U02.15 ; 77.15,12 R3-10k.2
+5V: length 91.6
  Bottom Layer w1.5: P2-5VIN.1 84.76,3.22 45,3.22 U01.15 33.91,14.31 33.91,41.34 R14-0.2
GND: length 475.5
  Top Layer w0.6: U2-TP4056.3 80.63,53.59 ; 80.63,53.59 79.13,53.59 78.09,52.55 U2-TP4056.1 ; 80.63,53.59 80.63,54.36 U2-TP4056.9
  Top Layer w0.7: R13-1k.2 79.85,22.25 CARD1.10 86.1,22.65 86.1,26.75 ; 86.1,26.75 CARD1.6 ; 86.1,26.75 87.6,26.75 88.7,27.85 88.7,33.85 CARD1.13
  Top Layer w0.8: 87.5,56 87.76,55.74 88.26,55.74 右传感器.2 ; 87.5,56 87.5,56.03 86.1,57.43 86.1,60.22 83.27,63.06 ; 87.5,56 82.09,50.59 81.36,50.59 80.63,51.32 U2-TP4056.3 ; R016-1k.2 25.75,34.4 ; R7-10k.1 17.46,16.21 v1(17.46,14.44) ; TYPE-C.1 57.71,67.08 74.29,67.08 78.14,63.23 83.27,63.23 D0输出-异常警报.2
  Top Layer w0.9: TYPE-C.1 52.92,63.69 TYPE-C.B12 ; TYPE-C.2 45.85,63.52 TYPE-C.A12 47.25,65.98 48.22,65.98 49.72,67.48 TYPE-C.3
  Top Layer w1: TYPE-C.1 TYPE-C.3 ; 47.25,65.98 TYPE-C.4 ; TYPE-C.2 35.18,63.69 33.68,62.19 31.54,62.19 传感器统一接线端3V3_G_L_R.2
  Top Layer w1.2: 94.3,22.25 94.3,14.57 右.2 ; 94.3,22.25 88.7,27.85 ; 94.3,22.25 CARD1.11 ; 95.25,37.8 86.65,37.8 CARD1.13 ; 95.25,37.8 CARD1.12 ; 95.25,37.8 95.25,38.75 97.19,40.69 97.19,42.81 v1(95.25,44.75)
  Top Layer w1.256: R16-1k.2 17.85,42 BUZZER1.2 ; R13-1k.2 74.1,28 v1(69.6,28) 69.6,20.36 U02.14
  Top Layer w1.353: 32.18,62.19 32.18,59.19 27.68,54.69 ; 27.68,54.69 20.18,54.69 19.86,55 左传感器.2 ; 27.68,54.69 27.68,52.57 R10-5k1.2
  Top Layer w1.485: U1-LT3481IMSE#PBF.11 20.72,23.26 19.5,24.49 19.5,26.91 C2-220pF.1
  Top Layer w1.5: P2-5VIN.2 82.46,9.71 84.08,11.33 94.88,11.33 95,11.21 ; 左传感器.2 9.5,55 5,59.5 SCREW1.1 ; C4-22uF.2 32,31.27 30.04,33.23 26.93,33.23 25.78,34.37 22.83,34.37 19.94,37.27 19.94,39.91 R16-1k.2 ; R6-200k.1 13.74,28 v1(13.83,28.09) ; 95,11.21 SCREW4.1 ; 95,11.21 95,11.23 93.73,12.5 右.2 ; C1-22uF.2 34.24,14.76 U01.14 36.76,14.76 36.89,14.89 36.89,15.02 38.59,16.72 38.59,23.21 36.88,24.92 U01.10 ; 13.86,55 13.86,42.06 BUZZER1.2 6.27,34.47 蜂鸣器等位LED.2 左.2 6.27,6.27 SCREW3.1 ; P1-BT.2 v1(17.46,14.44) v1(14.61,17.29) v1(14,17.9) v1(13.45,18.45) 11.91,19.99 D1-SS54.1 ; v2(19.8,29.61) C2-220pF.1
  Inner2 w1.2: D0输入-检查线路.2 v1(95.25,44.75)
  Inner2 w1.5: SCREW2.1 95,60.5 89.5,55 90.25,55 91,54.25 91,50.5 ; 91,50.5 91,48.5 D0输入-检查线路.1 ; 91,50.5 D0输入-检查线路.2 ; v1(19.2,30.2) 17.09,28.09 v1(13.83,28.09) 13.83,18.83 v1(13.45,18.45) v1(14,17.9) v1(14.61,17.29)
  Bottom Layer w1.256: U02.7 66.54,30 R12-2k4.1 68.85,28 v1(69.6,28)
  Bottom Layer w1.5: v2(19.8,29.61) v1(19.2,30.2) 19.2,31.29 20.7,32.79 30.61,32.79 32,31.4 C4-22uF.2 C1-22uF.2
BT+: length 113.3
  Top Layer w0.3: 24.38,19.59 23.35,19.59 22.72,20.22 22.72,20.5
  Top Layer w1: C1-22uF.1 29.87,16.87 29.87,15.55 35.3,10.13 37.27,10.13 60.28,33.15 60.28,47.28 v1(60.41,47.41) ; U2-TP4056.5 v1(83.41,57.91)
  Inner2 w0.6: v1(23.49,19.95) 24.07,20.53 ; v3(22.73,22) 24.2,20.53
  Inner2 w1: C1-22uF.1 26.47,20.53 24.2,20.53
  Inner2 w1.6: P1-BT.1 30,13.46 C1-22uF.1
  Bottom Layer w1: v1(83.41,57.91) 70.91,57.91 v1(60.41,47.41)
BUZZER: length 80.3
  Bottom Layer w1.5: 蜂鸣器等位LED.1 6.2,32.47 BUZZER1.1 9.2,39 14.16,39 17.16,42 23.16,42 27.66,46.5 29.16,46.5 32.16,49.5 38.16,49.5 47.5,40.16 U02.4
CS: length 32
  Top Layer w0.7: CARD1.2 v1(86.2,31.15)
  Inner2 w0.7: U02.11 65.43,20.95 65.43,19.38 66.93,17.88 72.18,17.88 85.45,31.15 v1(86.2,31.15)
LEFT: length 108.6
  Inner2 w1.5: U02.2 51.03,45.24 传感器统一接线端3V3_G_L_R.3 23.77,57.5 17.77,57.5 12.73,52.46 左传感器.3 9.79,52.46 8.29,50.96 8.29,28.25 3.73,23.69 左.1
MISO: length 56.3
  Top Layer w0.7: CARD1.7 83.2,25.65 80.2,28.65 80.2,37.95 R03-10k.1
  Top Layer w0.806: U02.9 67.01,27.46 69.7,30.15 74.2,30.15 75.7,28.65 80.2,28.65
  Top Layer w1.5: U02.9 61,24.46 61,12.17 63.18,10 R3-10k.1
MOSI: length 50.4
  Top Layer w0.7: CARD1.3 v1(86.2,30.05)
  Top Layer w0.8: R01-10k.1 79.41,44 v1(79.38,43.97)
  Inner2 w0.7: v1(86.2,30.05) 86.95,30.05 87.7,30.8 87.7,31.55 86.2,33.05 83.2,33.05 70.15,20 R1-10k.1
  Inner2 w0.8: v1(79.38,43.97) 79.38,36.88 83.2,33.05
  Inner2 w1.5: U02.10 66.85,22.07 R1-10k.1
RIGHT: length 108.9
  Bottom Layer w1.5: 72.27,41 96.27,17 右.1 ; 72.27,41 88.81,57.54 右传感器.3 ; 72.27,41 70.57,42.7 U02.3 62.5,42.7 40.2,65 传感器统一接线端3V3_G_L_R.4
SCK: length 59
  Top Layer w0.7: R02-10k.1 80.25,40.65 81.4,39.5 82.9,39.5 83.2,39.2 83.2,36.85 87.7,32.35 87.7,29.35 86.2,27.85 CARD1.5
  Top Layer w0.806: U02.8 65.65,31.65 v1(69.75,31.65) 71.25,31.65 80.25,40.65
  Bottom Layer w1.5: v1(69.75,31.65) 71.25,30.15 71.25,19.4 R2-10k.1
SWITCH: length 95.9
  Top Layer w0.806: U02.1 62.75,49.03 62.75,55.75 ; 62.75,55.75 49.25,55.75 v1(47.75,54.25) ; 62.75,55.75 64.25,55.75 64.75,55.25 v1(76.75,55.25)
  Inner2 w0.806: 81.25,55.25 v1(76.75,55.25)
  Inner2 w1.5: D0输入-检查线路.4 D0输入-检查线路.3 81.25,49.25 81.25,64.48 D0输出-异常警报.1
  Bottom Layer w0.806: R11-3k3.1 35.9,54.25 v1(47.75,54.25)
USBIN: length 94.8
  Top Layer w0.6: U2-TP4056.4 82.23,52.42 82.23,56.78 78.66,56.78 78.09,57.34 U2-TP4056.8 66.09,57.91 60.49,63.52 57.49,63.52 55.99,62.02 52.24,62.02 51.52,62.73 TYPE-C.B9
  Top Layer w0.8: TYPE-C.A9 48.51,64.48 49.05,65.02 50.99,65.02 51.52,64.48 TYPE-C.B9 ; R14-0.1 27.69,45 33.09,50.41 42.09,50.41 49.59,57.91 57.09,57.91 61.59,62.41
$1N5991: length 23.7
  Top Layer w0.7: R9-5k1.2 42.49,55 49.5,62.02 TYPE-C.B5
$1N5992: length 38.1
  Top Layer w0.7: TYPE-C.A5 50.5,60.52 41.5,51.52 v1(34,51.52)
  Bottom Layer w0.7: R10-5k1.1 21.27,51.52 v1(34,51.52)
$1N6384: length 23
  Top Layer w0.6: v1(77.87,44.59) 79.37,46.09 U2-TP4056.2
  Inner2 w0.6: v1(77.87,44.59) 77.87,30.72 R12-2k4.2
$1N6472: length 13.7
  Top Layer w0.6: U2-TP4056.6 80.63,59.41 77.63,62.41 73.32,62.41 充电中.1
$1N6520: length 22
  Top Layer w0.6: 充满.1 66.32,59.41 78.62,59.41 79.37,58.66 U2-TP4056.7
$1N6547: length 51.8
  Inner2 w1.353: 70.27,62 68.4,60.13 68.4,26.5 R13-1k.1
  Inner2 w1.5: 充电中.2 73.27,63.5 71.77,62 66.27,62 充满.2
$1N28440: length 55.4
  Top Layer w0.806: R016-1k.1 24.25,37.28 29.44,42.48 30.7,42.48 U01.1
  Inner2 w1.256: U01.1 30.15,41.93 R16-1k.1
  Inner2 w1.5: v1(25.5,56.2) 28.5,53.2 30,53.2 34.5,48.7 34.5,46.28
  Bottom Layer w1.5: R15可变.2 18.2,65 25.5,57.7 v1(25.5,56.2)
$1N40882: length 15
  Top Layer w0.3: U1-LT3481IMSE#PBF.2 21.72,19.97 21.33,19.58
  Top Layer w0.4: 21.33,19.58 20.45,19.58 16.91,23.12 16.91,25.28 16.69,25.5 13.91,25.5 C3-470nF.1
$1N40886: length 29.2
  Top Layer w0.35: 22.2,19.45 22.2,21.15
  Top Layer w0.6: 22.2,19.45 21.56,18.82 17.78,18.82 16.15,20.44
  Top Layer w1.485: C3-470nF.2 15.59,21 16.15,20.44 D1-SS54.2
  Top Layer w1.5: v4(26.68,17.83) 26.72,17.87 L1-4.7uH.1
  Inner2 w1.5: v4(17.53,19.2) 19.81,16.92 23.64,16.92 24.43,17.71 26.55,17.71 v4(26.68,17.83)
$1N41122: length 7.3
  Top Layer w0.4: R6-200k.2 v1(17.11,26.37) ; v1(20.98,26.37) 20.98,26.25 20.95,26.22 20.95,25.77 21.22,25.5 U1-LT3481IMSE#PBF.10
  Inner2 w0.4: v1(17.11,26.37) v1(20.98,26.37)
$1N41387: length 5.2
  Top Layer w0.3: U1-LT3481IMSE#PBF.9 21.72,25.71 21.67,25.77 21.67,26.23 21.6,26.3 21.6,26.6 21.58,26.61 21.58,26.99 v1(21.58,27)
  Top Layer w0.6: R4-30k.2 24,27.68 v1(23.98,27.66)
  Inner2 w0.6: v1(21.58,27) 21.7,27.13 23.45,27.13 v1(23.98,27.66)
$1N41394: length 3
  Top Layer w1.208: R4-30k.1 23.89,31.59 C2-220pF.2
$1N41433: length 1.2
  Top Layer w0.4: 23.23,21.15 24.33,21.15 24.38,21.1
$1N41446: length 14.4
  Top Layer w0.3: v6(22.22,26.36) 22.22,25.38
  Top Layer w0.6: v1(23.22,18.75) 23.25,18.73 R8-16.2k.1
  Top Layer w0.806: R7-10k.2 R8-16.2k.1
  Bottom Layer w0.4: v6(22.22,26.36) 22.18,26.32 22.18,19.67 23.1,18.75 v1(23.22,18.75)
  vias: v5(22.22,24.53)

## Copper pours and planes (outline as drawn; the poured copper is in the pictures)
GND on Inner1: 0,70 100,70 100,0 0,0

## Text on the board
Top Silkscreen Layer: - | + | Generic ESP8266 Module | 环境信息收集记录模块 | 天线区
